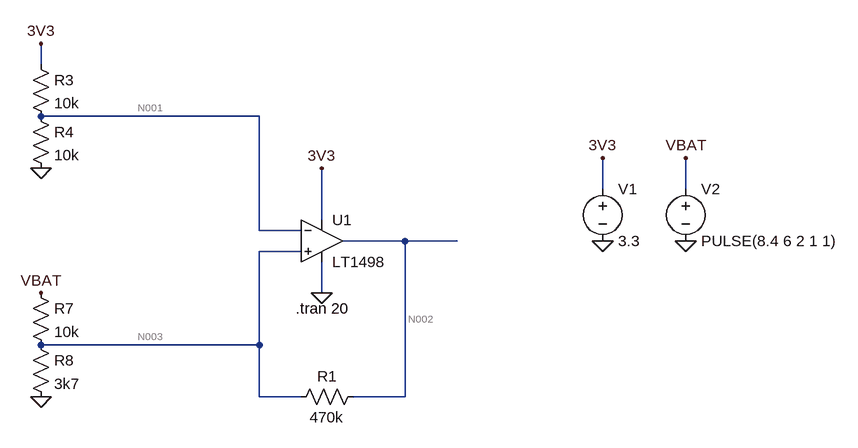
[diagram p0: schematic Draft1.asc]
Draft1.asc, the LTspice schematic file:
Version 4.1
SHEET 1 964 680
WIRE -272 -80 -272 -112
WIRE 64 0 -272 0
WIRE 592 112 592 64
WIRE 720 112 720 64
WIRE 160 160 160 80
WIRE 64 176 64 0
WIRE 128 176 64 176
WIRE 288 192 192 192
WIRE 368 192 288 192
WIRE 128 208 64 208
WIRE 160 272 160 224
WIRE 64 352 64 208
WIRE 64 352 -272 352
WIRE 64 432 64 352
WIRE 128 432 64 432
WIRE 288 432 288 192
WIRE 288 432 208 432
FLAG 160 272 0
FLAG 592 192 0
FLAG 720 192 0
FLAG 592 64 3V3
FLAG 720 64 VBAT
FLAG 160 80 3V3
FLAG -272 80 0
FLAG -272 -112 3V3
FLAG -272 272 VBAT
FLAG -272 432 0
SYMBOL voltage 592 96 R0
WINDOW 123 0 0 Left 0
WINDOW 39 0 0 Left 0
SYMATTR InstName V1
SYMATTR Value 3.3
SYMBOL voltage 720 96 R0
WINDOW 123 0 0 Left 0
WINDOW 39 0 0 Left 0
SYMATTR InstName V2
SYMATTR Value PULSE(8.4 6 2 1 1)
SYMBOL res -288 -96 R0
SYMATTR InstName R3
SYMATTR Value 10k
SYMBOL res -288 -16 R0
SYMATTR InstName R4
SYMATTR Value 10k
SYMBOL res -288 256 R0
SYMATTR InstName R7
SYMATTR Value 10k
SYMBOL res -288 336 R0
SYMATTR InstName R8
SYMATTR Value 3k7
SYMBOL res 224 416 R90
WINDOW 0 0 56 VBottom 2
WINDOW 3 32 56 VTop 2
SYMATTR InstName R1
SYMATTR Value 470k
SYMBOL OpAmps\\LT1498 160 128 R0
SYMATTR InstName U1
TEXT 120 296 Left 2 !.tran 20

The netlist it stands for:
* Draft1.asc
V1 3V3 0 3.3
V2 VBAT 0 PULSE(8.4 6 2 1 1)
R3 3V3 N001 10k
R4 N001 0 10k
R7 VBAT N003 10k
R8 N003 0 3k7
R1 N002 N003 470k
X§U1 N003 N001 3V3 0 N002 LT1498  ; pins In+ In- V+ V- OUT
.tran 20
.lib LTC.lib
.backanno
.end

* Results of the author's LTspice run, read from the files saved beside the schematic
* Operating Point, zero values left out:
*   V(vbat) = 8.4 V
*   V(n003) = 2.275 V
*   V(n002) = 3.296 V
*   V(3v3) = 3.3 V
*   V(n001) = 1.651 V
*   I(V1) = -840.8 µA
*   I(R3) = 164.9 µA
*   I(R7) = 612.5 µA
*   I(R8) = 614.9 µA
*   I(R4) = 165.1 µA
*   I(V2) = -612.5 µA
*   I(R1) = 2.171 µA
*   Ix(u1:1) = -241.8 nA
*   Ix(u1:2) = -256.8 nA
*   Ix(u1:3) = 675.9 µA
*   Ix(u1:4) = -673.3 µA
*   Ix(u1:5) = -2.171 µA
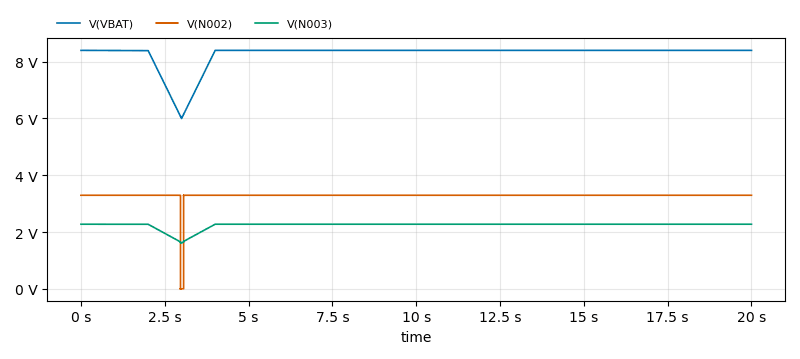
[diagram p1: Transient Analysis of Draft1.asc, plotted from the saved traces]
* Transient Analysis, 1 run:
*   V(VBAT): min 6 V, max 8.4 V, average 8.279 V, rms 8.293 V, last 8.4 V
*   V(N002): min -140 µV, max 3.296 V, average 3.28 V, rms 3.288 V, last 3.296 V
*   V(N003): min 1.612 V, max 2.275 V, average 2.243 V, rms 2.246 V, last 2.275 V